# Altium schematic sheet Staj_Blok.SchDoc
size A4
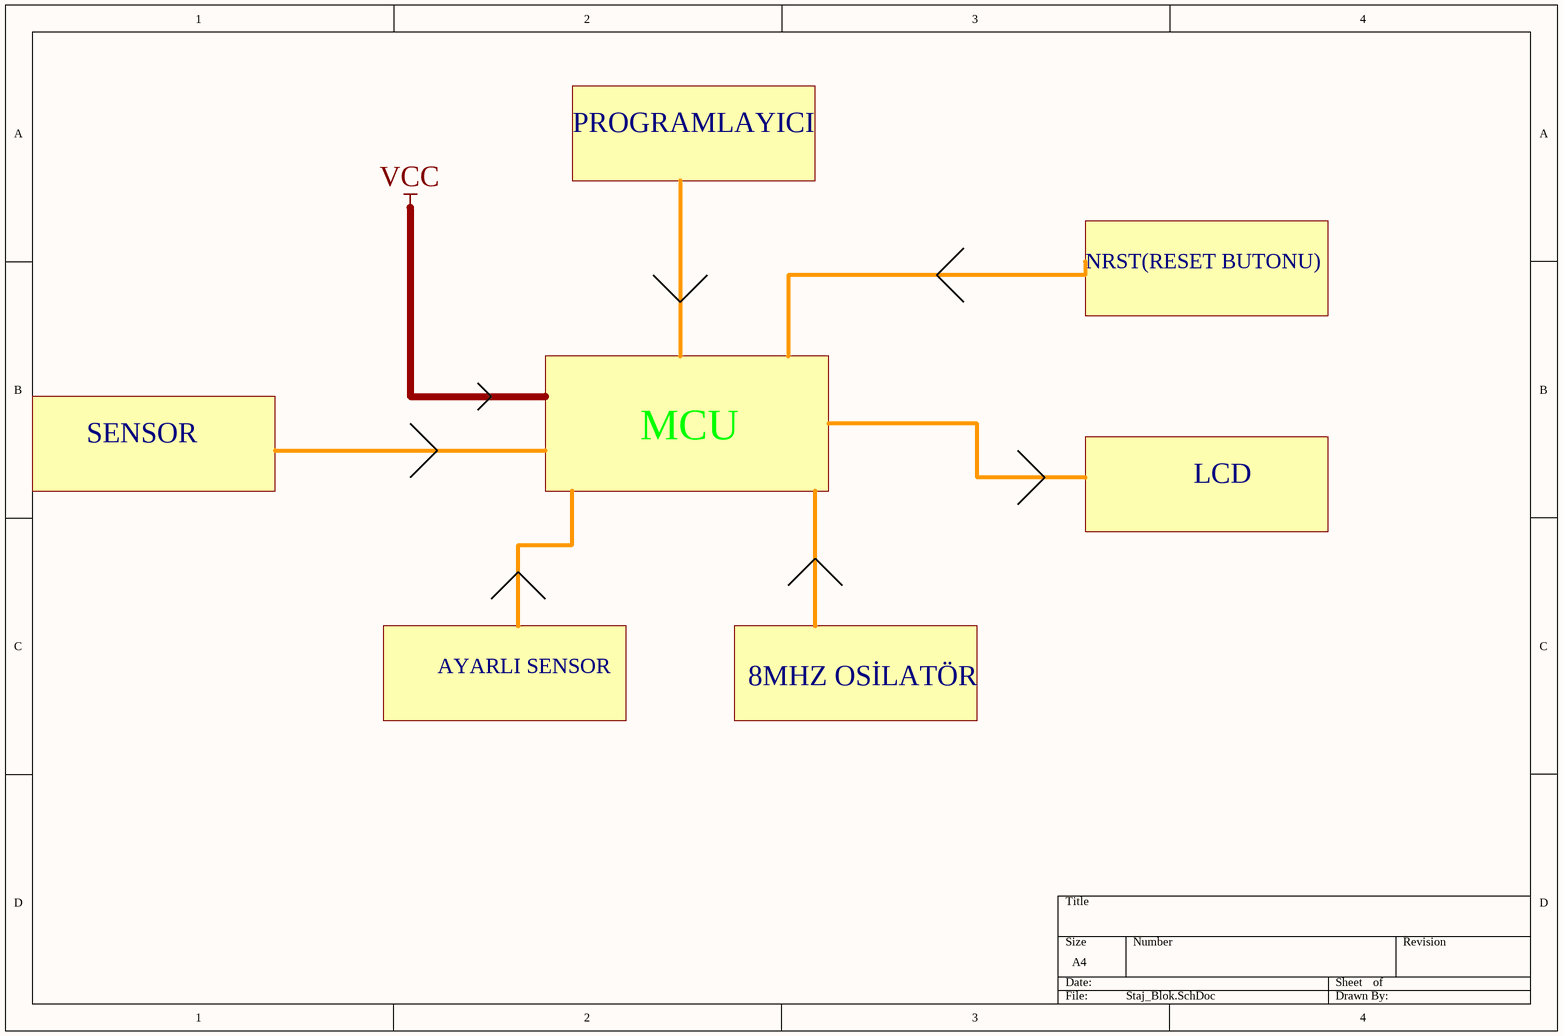
[diagram p0: Staj_Blok.SchDoc]

## Notes on the sheet
- PROGRAMLAYICI
- NRST(RESET BUTONU)
- SENSOR
- MCU
- LCD
- AYARLI SENSOR
- 8MHZ OSİLATÖR